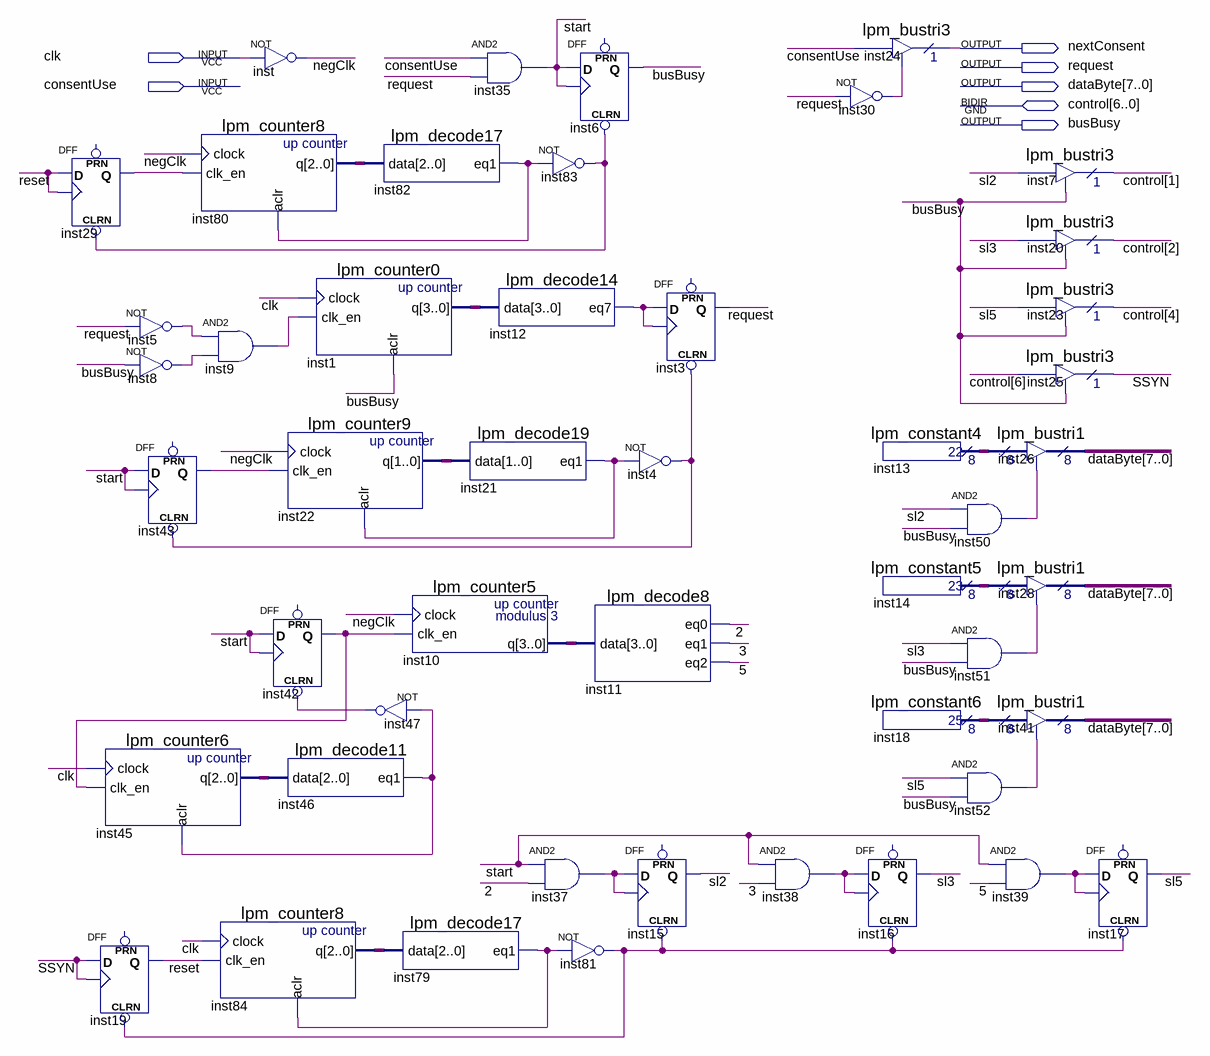
[diagram p0: schematic sheet]
// Quartus schematic Master2.bdf as structural Verilog: 48 symbols, 7 pins
module Master2 (
  input  clk,
  input  consentUse,
  inout  [6:0] control,
  output nextConsent,
  output request,
  output [7:0] dataByte,
  output busBusy
);

  wire \2 , \3 , \5 , inst4_out, inst5_out, inst8_out, inst9_out, inst12_eq7, inst21_eq1, inst29_q,
       inst30_out, inst37_out, inst38_out, inst39_out, inst42_q, inst43_q, inst46_eq1, inst47_out,
       inst50_out, inst51_out, inst52_out, inst79_eq1, inst81_out, inst82_eq1, inst83_out, negClk, reset,
       sl2, sl3, sl5, SSYN, start;
  wire [1:0] inst22_q;
  wire [2:0] inst45_q, inst80_q, inst84_q;
  wire [3:0] inst1_q, inst10_q;
  wire [7:0] inst13_result, inst14_result, inst18_result;

  DFF inst29 (.CLRN(inst83_out), .CLK(reset), .D(reset), .Q(inst29_q));  // open: PRN
  lpm_counter6 inst45 (.clock(clk), .clk_en(inst42_q), .aclr(inst46_eq1), .q(inst45_q));
  DFF inst19 (.CLRN(inst81_out), .CLK(SSYN), .D(SSYN), .Q(reset));  // open: PRN
  not inst5 (inst5_out, request);
  not inst8 (inst8_out, busBusy);
  DFF inst43 (.CLRN(inst4_out), .CLK(start), .D(start), .Q(inst43_q));  // open: PRN
  not inst (negClk, clk);
  lpm_counter8 inst80 (.clock(negClk), .clk_en(inst29_q), .aclr(inst82_eq1), .q(inst80_q));
  and inst9 (inst9_out, inst5_out, inst8_out);
  lpm_counter8 inst84 (.clock(clk), .clk_en(reset), .aclr(inst79_eq1), .q(inst84_q));
  lpm_counter0 inst1 (.clock(clk), .clk_en(inst9_out), .aclr(busBusy), .q(inst1_q));
  lpm_counter9 inst22 (.clock(negClk), .clk_en(inst43_q), .aclr(inst21_eq1), .q(inst22_q));
  DFF inst42 (.CLRN(inst47_out), .CLK(start), .D(start), .Q(inst42_q));  // open: PRN
  lpm_decode11 inst46 (.data(inst45_q), .eq1(inst46_eq1));
  lpm_decode17 inst82 (.data(inst80_q), .eq1(inst82_eq1));
  lpm_counter5 inst10 (.clock(negClk), .clk_en(inst42_q), .q(inst10_q));
  not inst47 (inst47_out, inst46_eq1);
  lpm_decode17 inst79 (.data(inst84_q), .eq1(inst79_eq1));
  and inst35 (start, consentUse, request);
  lpm_decode14 inst12 (.data(inst1_q), .eq7(inst12_eq7));
  lpm_decode19 inst21 (.data(inst22_q), .eq1(inst21_eq1));
  not inst83 (inst83_out, inst82_eq1);
  and inst37 (inst37_out, start, \2 );
  not inst81 (inst81_out, inst79_eq1);
  DFF inst6 (.CLRN(inst83_out), .CLK(start), .D(start), .Q(busBusy));  // open: PRN
  not inst4 (inst4_out, inst21_eq1);
  lpm_decode8 inst11 (.data(inst10_q), .eq0(\2 ), .eq1(\3 ), .eq2(\5 ));
  DFF inst15 (.CLRN(inst81_out), .CLK(inst37_out), .D(inst37_out), .Q(sl2));  // open: PRN
  DFF inst3 (.CLRN(inst4_out), .CLK(inst12_eq7), .D(inst12_eq7), .Q(request));  // open: PRN
  and inst38 (inst38_out, start, \3 );
  lpm_bustri3 inst24 (.enabledt(inst30_out), .data(consentUse), .tridata(nextConsent));
  not inst30 (inst30_out, request);
  lpm_constant4 inst13 (.result(inst13_result));
  lpm_constant5 inst14 (.result(inst14_result));
  lpm_constant6 inst18 (.result(inst18_result));
  DFF inst16 (.CLRN(inst81_out), .CLK(inst38_out), .D(inst38_out), .Q(sl3));  // open: PRN
  lpm_bustri3 inst7 (.enabledt(busBusy), .data(sl2), .tridata(control[1]));
  lpm_bustri3 inst20 (.enabledt(busBusy), .data(sl3), .tridata(control[2]));
  lpm_bustri3 inst23 (.enabledt(busBusy), .data(sl5), .tridata(control[4]));
  lpm_bustri3 inst25 (.enabledt(busBusy), .data(control[6]), .tridata(SSYN));
  lpm_bustri1 inst26 (.enabledt(inst50_out), .data(inst13_result), .tridata(dataByte));
  and inst50 (inst50_out, sl2, busBusy);
  lpm_bustri1 inst28 (.enabledt(inst51_out), .data(inst14_result), .tridata(dataByte));
  and inst51 (inst51_out, sl3, busBusy);
  lpm_bustri1 inst41 (.enabledt(inst52_out), .data(inst18_result), .tridata(dataByte));
  and inst52 (inst52_out, sl5, busBusy);
  and inst39 (inst39_out, start, \5 );
  DFF inst17 (.CLRN(inst81_out), .CLK(inst39_out), .D(inst39_out), .Q(sl5));  // open: PRN
endmodule
